# EAGLE design DEC8i-buscon (EAGLE 6.6.0)
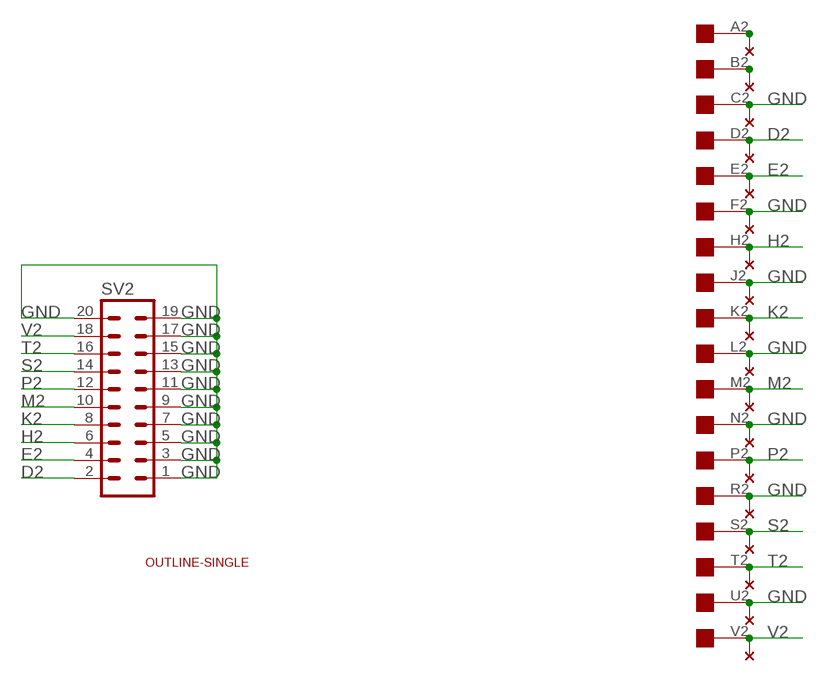
[diagram p0: schematic, sheet 1]

## Parts
SV2  MA10-2  [MA10-2]
U$4  EDGE-1  [EDGE-CON1]
U$5  THRU-HOLE1  [THRU-HOLE1]
U$6  OUTLINE-SINGLE  [SINGLE]

## Nets
D2: SV2.2 U$4.D2 U$5.D2
E2: SV2.4 U$4.E2 U$5.E2
GND: SV2.1 SV2.3 SV2.5 SV2.7 SV2.9 SV2.11 SV2.13 SV2.15 SV2.17 SV2.19 SV2.20 U$4.C2 U$4.F2 U$4.J2 U$4.L2 U$4.N2 U$4.R2 U$4.U2 U$5.C2 U$5.F2 U$5.J2 U$5.L2 U$5.N2 U$5.R2 U$5.U2
H2: SV2.6 U$4.H2 U$5.H2
K2: SV2.8 U$4.K2 U$5.K2
M2: SV2.10 U$4.M2 U$5.M2
N$1: U$4.B2 U$5.B2
N$2: U$4.A2 U$5.A2
P2: SV2.12 U$4.P2 U$5.P2
S2: SV2.14 U$4.S2 U$5.S2
T2: SV2.16 U$4.T2 U$5.T2
V2: SV2.18 U$4.V2 U$5.V2

## Library data of the parts
SV2 = con-lstb:MA10-2: PIN HEADER; OC_FARNELL: unknown; OC_NEWARK: unknown
U$4 = dec-con:EDGE-1: Single-Sided DEC Edge Connector -- (side 2)
U$5 = dec-con:THRU-HOLE1: Thru-Hole addition to double-sided edge connector.
U$6 = dec-con:OUTLINE-*: Board outlines for DEC boards.

## Board
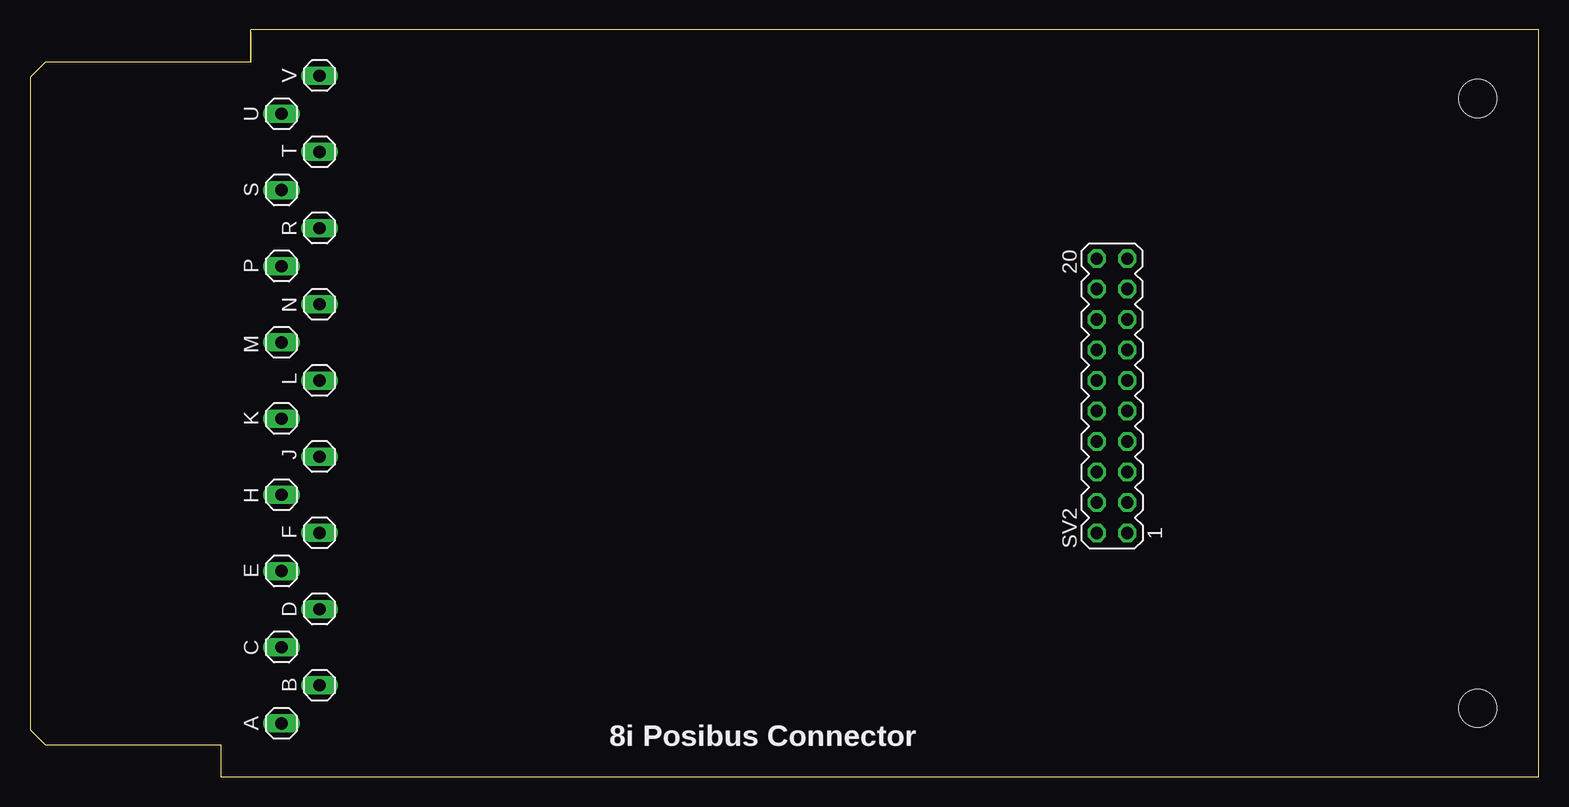
[diagram p1: board, top side]
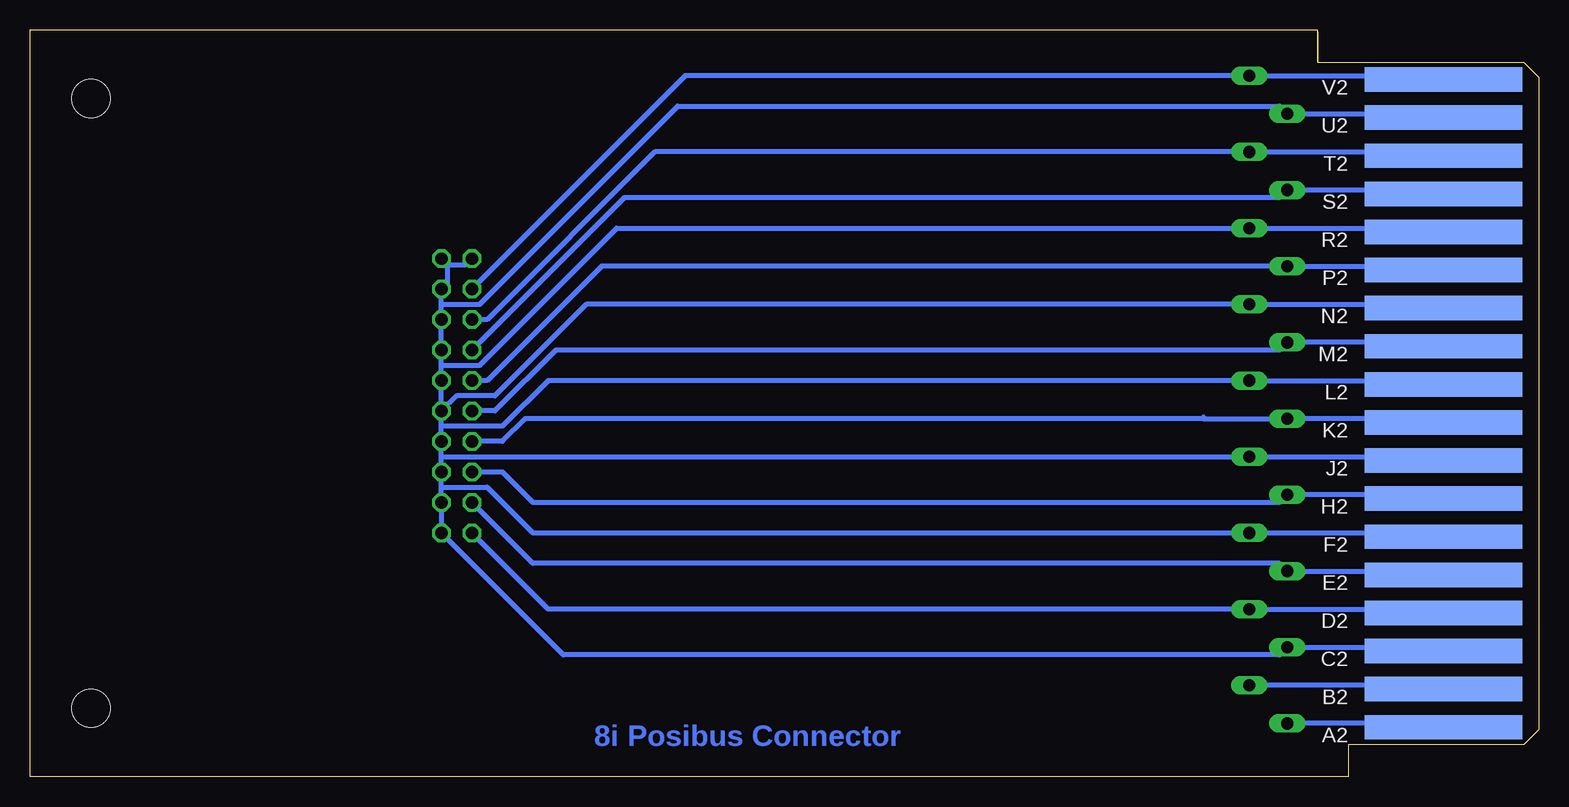
[diagram p2: board, bottom side, seen from below]

Size 125.73 x 62.23 mm. Coordinates in mm from the lower left corner, seen from the top.
Copper layers (1+16): Top 0.035mm / dielectric 1.5mm / Bottom 0.035mm
Design rules "16mils": minimum track width 16mil, minimum drill 32mil, track to track 15mil, track to pad 10mil, pad to pad 10mil, via to via 10mil, smd to smd 10mil, copper to edge 13mil, drill to drill 10mil, minimum pad ring 10mil, minimum via ring 8mil, stop-mask expansion 0mil, vias tented up to drill 0mil, thermal gap 10mil

### Footprints (pad centres in the part's own frame; a part is rotated, then mirrored left to right if it is on the bottom)
MA10-2 = drill 1.016 octagon: 1 -11.43,-1.27; 2 -11.43,1.27; 3 -8.89,-1.27; 4 -8.89,1.27; 5 -6.35,-1.27; 6 -6.35,1.27; 7 -3.81,-1.27; 8 -3.81,1.27; 9 -1.27,-1.27; 10 -1.27,1.27; 11 1.27,-1.27; 12 1.27,1.27; 13 3.81,-1.27; 14 3.81,1.27; 15 6.35,-1.27; 16 6.35,1.27; 17 8.89,-1.27; 18 8.89,1.27; 19 11.43,-1.27; 20 11.43,1.27
EDGE-CON1 = smd 13.106 x 2.032 bottom: A2 7.938,4.128; B2 7.938,7.303; C2 7.938,10.477; D2 7.938,13.652; E2 7.938,16.828; F2 7.938,20.003; H2 7.938,23.177; J2 7.938,26.352; K2 7.938,29.527; L2 7.938,32.703; M2 7.938,35.877; N2 7.938,39.053; P2 7.938,42.227; R2 7.938,45.403; S2 7.938,48.578; T2 7.938,51.752; U2 7.938,54.928; V2 7.938,58.102
THRU-HOLE1 = drill 1.016 long: A2 28.575,3.175; B2 25.4,6.35; C2 22.225,3.175; D2 19.05,6.35; E2 15.875,3.175; F2 12.7,6.35; H2 9.525,3.175; J2 6.35,6.35; K2 3.175,3.175; L2 0,6.35; M2 -3.175,3.175; N2 -6.35,6.35; P2 -9.525,3.175; R2 -12.7,6.35; S2 -15.875,3.175; T2 -19.05,6.35; U2 -22.225,3.175; V2 -25.4,6.35
SINGLE = hole 3.175: 120.65,56.515; 120.65,5.715

### Placement (x,y rotation side)
SV2  90.17,31.75 90 top
U$4  0,0 0 top
U$5  17.78,33.02 270 top
U$6  0,0 0 top

### Tracks (layer width: path | path; a pad name or v marks a point on that pad's centre or on a via)
D2
  Bottom 0.406: SV2.2 82.55,13.97 U$5.D2 8.26,13.97 U$4.D2
E2
  Bottom 0.406: SV2.4 83.82,17.78 21.59,17.78 U$5.E2 8.26,17.14 U$4.E2
GND
  Bottom 0.406: 90.93,42.67 89.41,42.67 SV2.20 | 90.93,42.67 90.93,41.15 SV2.17 91.44,39.37 | 90.93,42.67 SV2.19 | 91.44,24.13 87.63,24.13 83.82,20.32 U$5.F2 8.26,20.32 U$4.F2 | 91.44,24.13 SV2.5 91.44,26.67 | 91.44,24.13 SV2.3 SV2.1 81.28,10.16 21.59,10.16 U$5.C2 8.26,10.79 U$4.C2 | 91.44,26.67 SV2.7 91.44,29.21 | 91.44,29.21 SV2.9 | U$4.J2 8.26,26.67 U$5.J2 91.44,26.67 | U$4.L2 8.26,33.02 U$5.L2 82.55,33.02 86.36,29.21 91.44,29.21 | U$4.N2 8.26,39.37 U$5.N2 79.38,39.37 87,31.75 90.17,31.75 SV2.9 | U$4.R2 8.26,45.72 U$5.R2 76.84,45.72 88.27,34.29 91.44,34.29 | U$4.U2 8.26,55.24 U$5.U2 21.59,55.88 71.76,55.88 88.27,39.37 91.44,39.37 | 91.44,34.29 SV2.11 SV2.9 | 91.44,34.29 SV2.13 SV2.15 91.44,39.37
H2
  Bottom 0.406: U$4.H2 8.26,23.5 U$5.H2 21.59,22.86 83.82,22.86 86.36,25.4 SV2.6
K2
  Bottom 0.406: 27.94,29.84 U$5.K2 8.26,29.84 U$4.K2 | 27.94,29.84 27.94,29.97 | 27.94,29.84 84.46,29.84 86.36,27.94 SV2.8
M2
  Bottom 0.406: U$4.M2 8.26,36.2 U$5.M2 21.59,35.56 81.92,35.56 87,30.48 SV2.10
N$1
  Bottom 0.406: U$5.B2 8.26,7.62 U$4.B2
N$2
  Bottom 0.406: U$5.A2 8.26,4.45 U$4.A2
P2
  Bottom 0.406: SV2.12 87.63,33.02 78.11,42.55 U$5.P2 8.26,42.55 U$4.P2
S2
  Bottom 0.406: U$4.S2 8.26,48.9 U$5.S2 21.59,48.26 76.2,48.26 SV2.14
T2
  Bottom 0.406: SV2.16 87.63,38.1 73.66,52.07 U$5.T2 8.26,52.07 U$4.T2
V2
  Bottom 0.406: SV2.18 71.12,58.42 U$5.V2 8.26,58.42 U$4.V2

### Text on the board
Bottom: 8i Posibus Connector
tPlace: 8i Posibus Connector